# EAGLE design bot_power supply pcb (EAGLE 9.6.2)
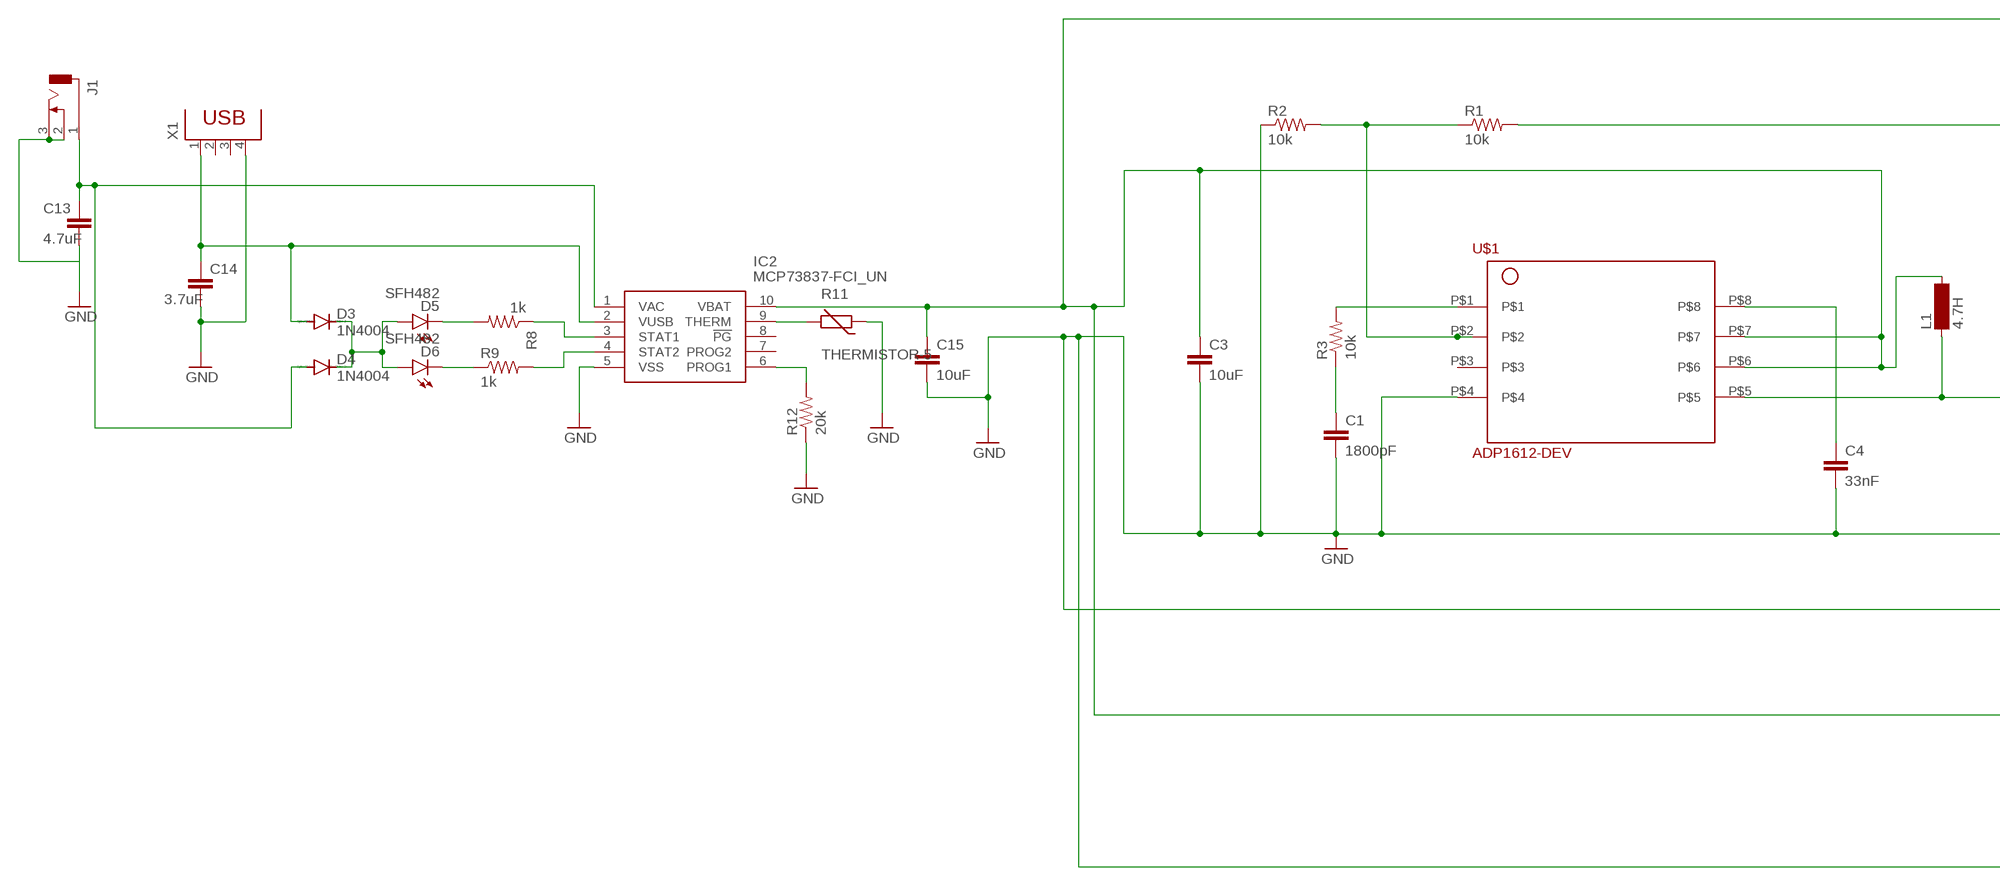
[diagram p0: schematic, sheet 1, part 1 of 2]
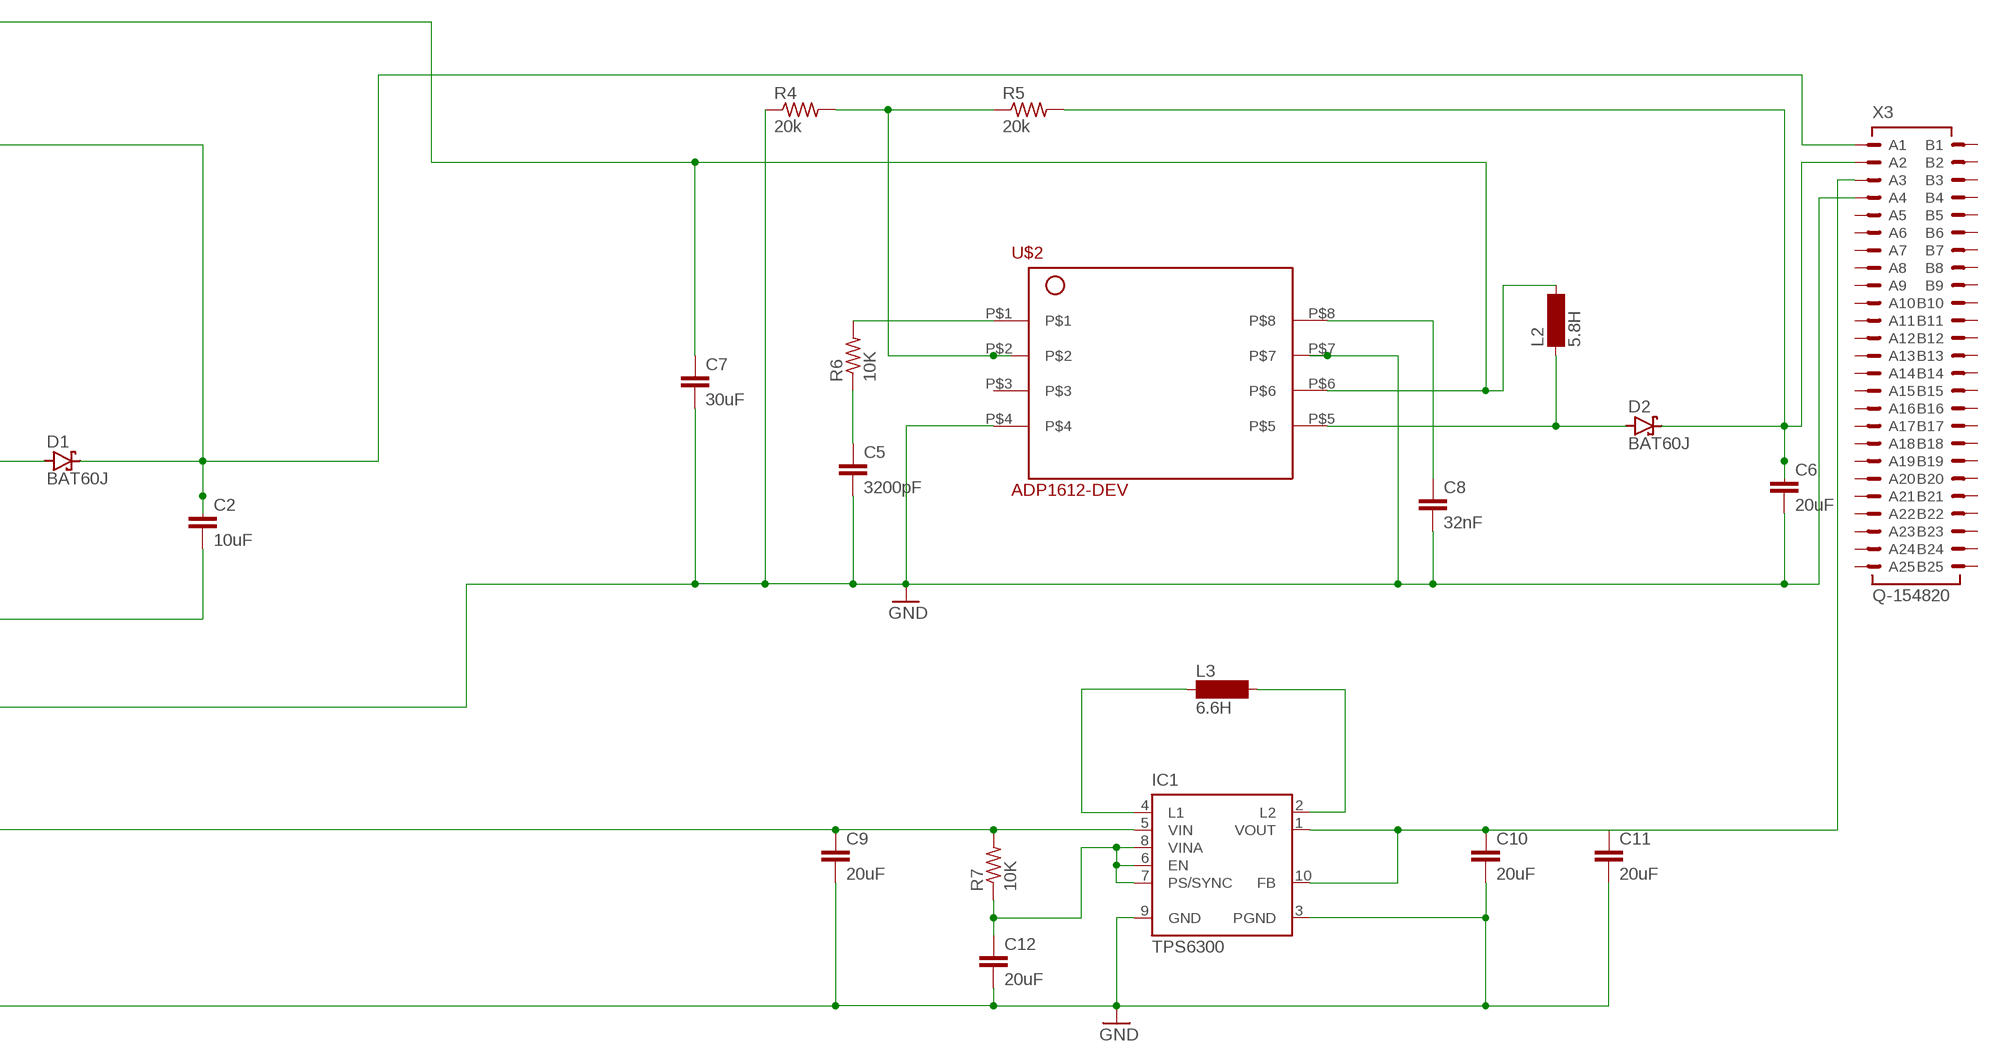
[diagram p1: schematic, sheet 1, part 2 of 2]

## Parts
C1  1800pF  C2.5/4  [C2.5-4]
C2  10uF  C2.5/4  [C2.5-4]
C3  10uF  C2.5/4  [C2.5-4]
C4  33nF  C2.5/4  [C2.5-4]
C5  3200pF  C2.5/4  [C2.5-4]
C6  20uF  C2.5/4  [C2.5-4]
C7  30uF  C2.5/4  [C2.5-4]
C8  32nF  C2.5/4  [C2.5-4]
C9  20uF  C2,5-3  [C2.5-3]
C10  20uF  C2,5-3  [C2.5-3]
C11  20uF  C2,5-3  [C2.5-3]
C12  20uF  C2,5-3  [C2.5-3]
C13  4.7uF  C2,5-3  [C2.5-3]
C14  3.7uF  C2,5-3  [C2.5-3]
C15  10uF  C2,5-3  [C2.5-3]
D1  BAT60J  [SOD323_ST]
D2  BAT60J  [SOD323_ST]
D3  1N4004  [DO41-10]
D4  1N4004  [DO41-10]
D5  SFH482  [SFH482]
D6  SFH482  [SFH482]
IC1  TPS6300  [DRC-S-PVSON-N10]
IC2  MCP73837-FCI_UN  [SOP50P490X110-10N]
J1  DCJ0303  [DCJ0303]
L1  4.7H  BS11  [BS11]
L2  5.8H  BS11  [BS11]
L3  6.6H  BS75  [BS75]
R1  10k  R-US_0204/7  [0204/7]
R2  10k  R-US_0204/7  [0204/7]
R3  10k  R-US_0204/7  [0204/7]
R4  20k  R-US_0204/7  [0204/7]
R5  20k  R-US_0204/7  [0204/7]
R6  10K  R-US_0204/7  [0204/7]
R7  10K  R-US_0204/5  [0204/5]
R8  1k  R-US_0204/5  [0204/5]
R9  1k  R-US_0204/5  [0204/5]
R11  THERMISTOR-5  [R-5]
R12  20k  R-US_0204/5  [0204/5]
U$1  ADP1612-DEV  [TQFP-ADP1612]
U$2  ADP1612-DEV  [TQFP-ADP1612]
X1  PN61729  [PN61729]
X3  Q-154820  [154820]

## Nets
GND: C1.2 C2.2 C3.2 C4.2 C5.2 C6.2 C7.2 C8.2 C9.2 C10.2 C11.2 C12.2 C13.2 C14.1 C14.2 C15.2 D3.A IC1.3(PGND) IC1.9(GND) IC2.2(VUSB) IC2.5(VSS) J1.2 J1.3 R2.1 R4.1 R11.1 R12.1 U$1.P$4 U$2.P$4 U$2.P$7 X1.1 X1.4 X3.A4
N$1: R3.2 U$1.P$1
N$2: C1.1 R3.1
N$3: R1.1 R2.2 U$1.P$2
N$4: C2.1 D1.C R1.2 X3.A1
N$5: D1.A L1.1 U$1.P$5
N$6: C4.1 U$1.P$8
N$8: C3.1 C7.1 C9.1 C15.1 IC1.5(VIN) IC2.10(VBAT) L1.2 L2.2 R7.2 U$1.P$6 U$1.P$7 U$2.P$6
N$9: R6.2 U$2.P$1
N$10: C5.1 R6.1
N$11: R4.2 R5.1 U$2.P$2
N$12: C6.1 D2.C R5.2 X3.A2
N$13: C8.1 U$2.P$8
N$14: D2.A L2.1 U$2.P$5
N$16: IC1.4(L1) L3.1
N$17: IC1.2(L2) L3.2
N$18: C10.1 C11.1 IC1.1(VOUT) IC1.10(FB) X3.A3
N$19: IC2.9(THERM) R11.2
N$20: C12.1 IC1.6(EN) IC1.7(PS/SYNC) IC1.8(VINA) R7.1
N$21: IC2.6(PROG1) R12.2
N$22: D5.K(C) R8.2
N$23: D6.K(C) R9.1
N$24: C13.1 D4.A IC2.1(VAC) J1.1
N$25: IC2.3(STAT1) R8.1
N$26: IC2.4(STAT2) R9.2
N$28: D3.C D4.C D5.A D6.A
Unconnected: IC1.TH IC2.7(PROG2) IC2.8(!PG) U$1.P$3 U$2.P$3 X1.2 X1.3 X3.A5 X3.A6 X3.A7 X3.A8 X3.A9 X3.A10 X3.A11 X3.A12 X3.A13 X3.A14 X3.A15 X3.A16 X3.A17 X3.A18 X3.A19 X3.A20 X3.A21 X3.A22 X3.A23 X3.A24 X3.A25 X3.B1 X3.B2 X3.B3 X3.B4 X3.B5 X3.B6 X3.B7 X3.B8 X3.B9 X3.B10 X3.B11 X3.B12 X3.B13 X3.B14 X3.B15 X3.B16 X3.B17 X3.B18 X3.B19 X3.B20 X3.B21 X3.B22 X3.B23 X3.B24 X3.B25

## Library data of the parts
C1-C15 = capacitor-wima:C: CAPACITOR naming: grid - package width
D1 D2 = diode:BAT60J: Schottky barrier diode Source: www.st.com, BAT60J.pdf
D3 D4 = diode:1N4004: DIODE general purpose rectifier, 1 A
D5 D6 = led:SFH482: IR LED infrared emitting diode, Infineon
IC1 = texas:TPS6300*: HIGH EFFICIENT SINGLE INDUCTOR BUCK-BOOST CONVERTER WITH 1.8-A SWITCHES Source: http://focus.ti.com/lit/ds/symlink/tps63001.pdf; MPN: TPS63000DRCTG4; OC_FARNELL: 1511852; OC_NEWARK: 59M7217
IC2 = MCP73837-FCI_UN:MCP73837-FCI_UN: Li-Ion Charger USB/DC 4.2V 1A PG MSOP10 Source: Datasheet <http://ww1.microchip.com/downloads/en/DeviceDoc/22071B.pdf>; ARROW_PART_NUMBER: MCP73837-FCI/UN; ARROW_PRICE-STOCK: https://www.arrow.com/en/products/mcp73837-fciun/microchip-technology; DESCRIPTION: Li-Ion Charger USB/DC 4.2V 1A PG MSOP10; HEIGHT: 1.1mm; MANUFACTURER_NAME: Microchip; MANUFACTURER_PART_NUMBER: MCP73837-FCI/UN; MOUSER_PART_NUMBER: 579-MCP73837-FCI/UN; MOUSER_PRICE-STOCK: https://www.mouser.co.uk/ProductDetail/Microchip-Technology/MCP73837-FCI-UN?qs=hH%252BOa0VZEiDKGj395FRsiw%3D%3D
J1 = con-jack:DCJ0303: DC POWER JACK Source: DCJ0303.pdf; OC_FARNELL: unknown; OC_NEWARK: unknown
L1-L3 = inductor-neosid:BS: INDUCTOR nominal inductance, magnetically screened; OC_FARNELL: unknown; OC_NEWARK: unknown
R1-R9 R12 = rcl:R-US_: RESISTOR, American symbol; SPICEPREFIX: R
R11 = varistor:THERMISTOR: THERMISTOR
U$1 U$2 = ADP1612:ADP1612-DEV
X1 = con-berg:PN61729: BERG USB connector; OC_FARNELL: unknown; OC_NEWARK: unknown
X3 = con-erni:Q-154820: Male Connector SMC-Q 50 contacts Type 7-13 - Low Profile Source: http://www.erni.com/DB/PDF-Drawing/SMC/154820.pdf; OC_FARNELL: unknown; OC_NEWARK: unknown

## Board
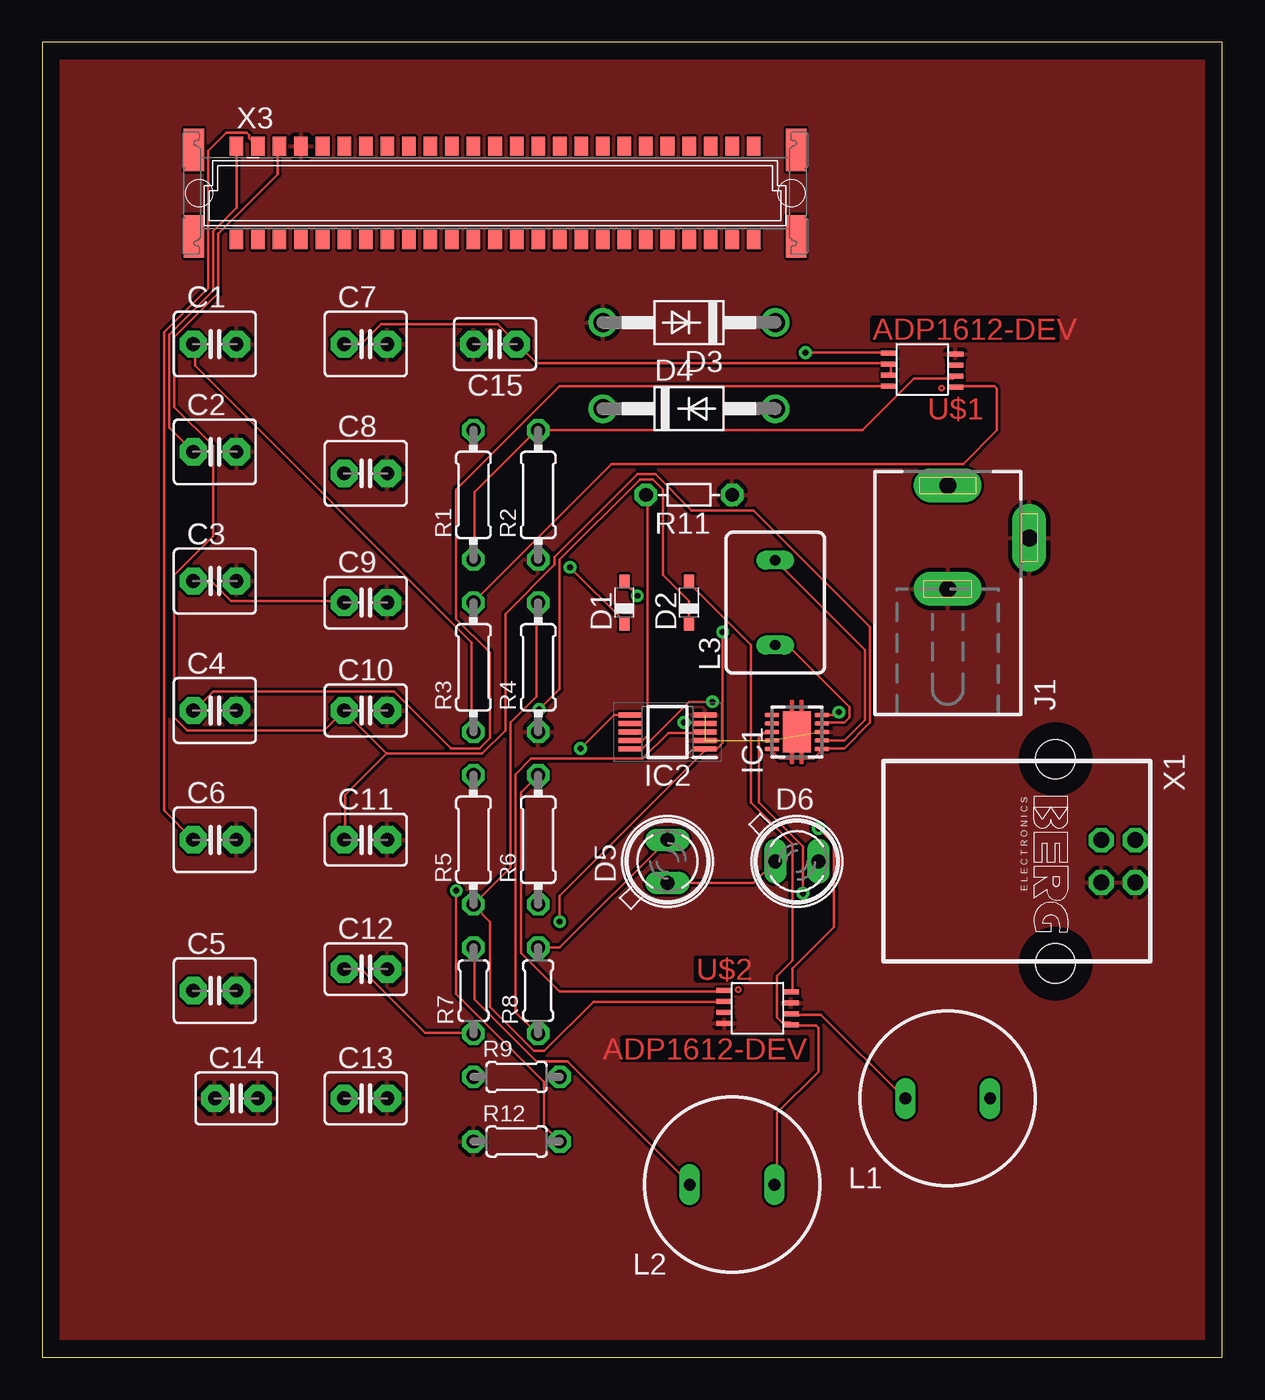
[diagram p2: board, top side]
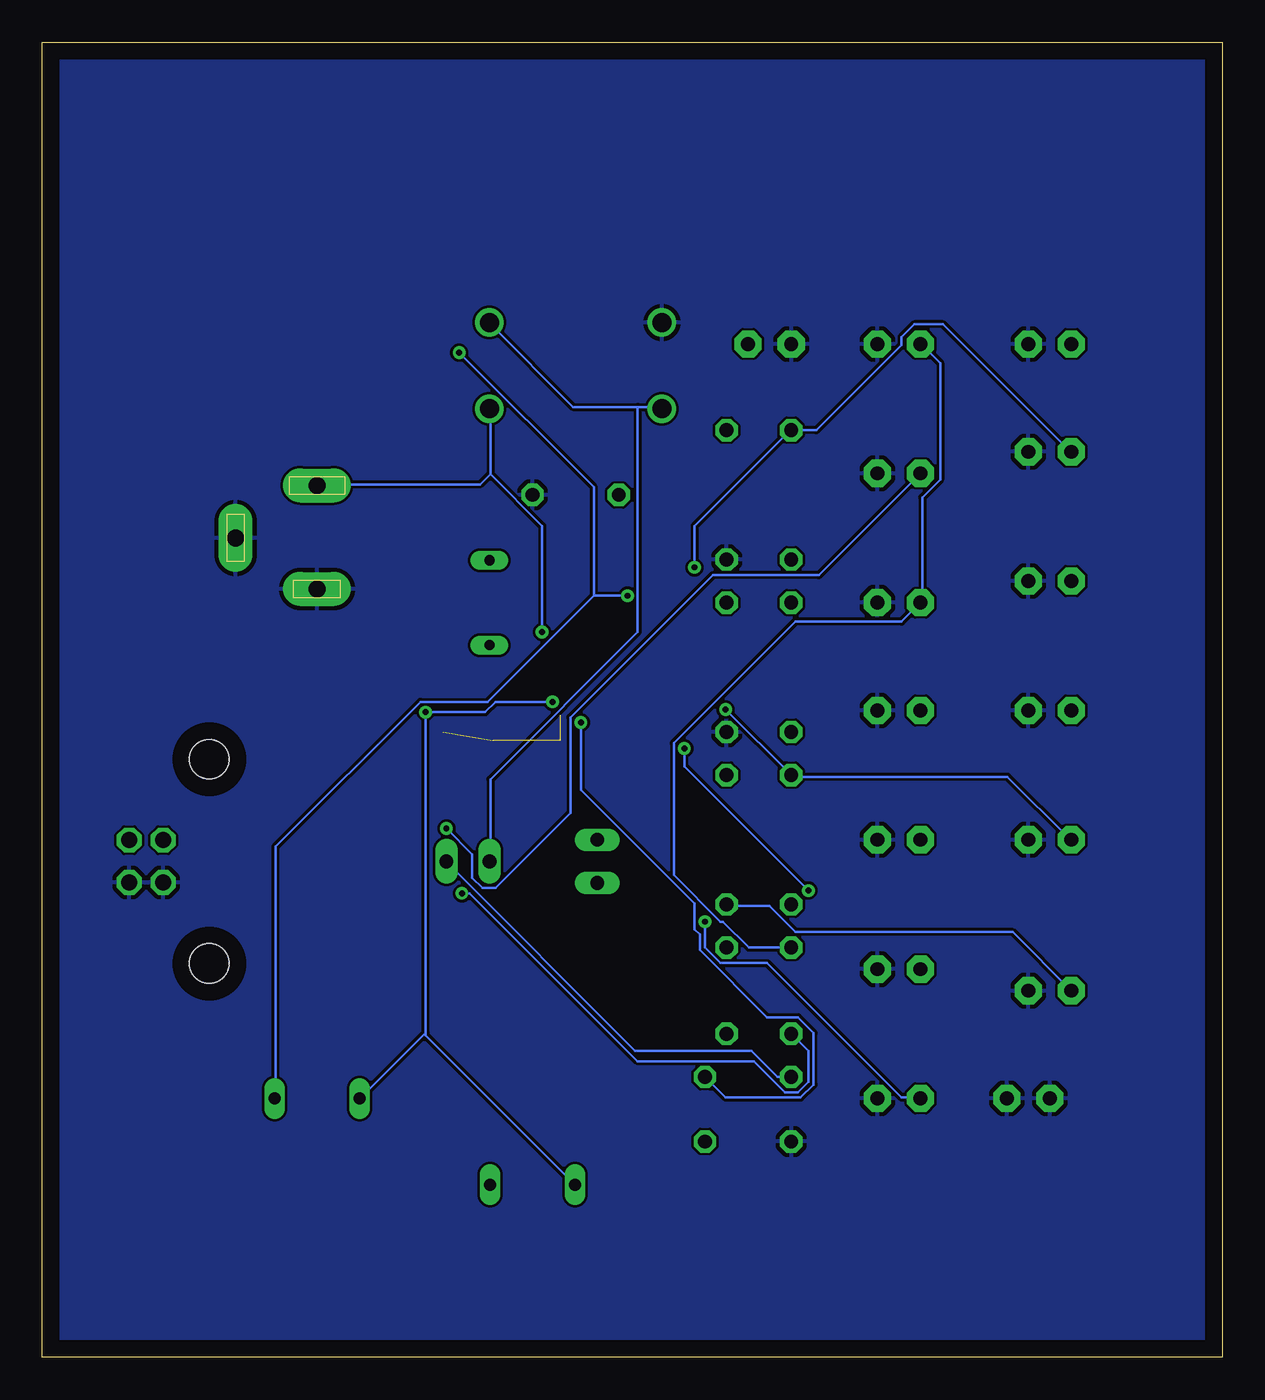
[diagram p3: board, bottom side, seen from below]

Size 69.52 x 77.46 mm. Coordinates in mm from the lower left corner, seen from the top.
Outline: 0,0 69.52,0 69.52,77.46 0,77.46 0,0
Copper layers (1*16): Top 0.035mm / dielectric 1.5mm / Bottom 0.035mm
Design rules "default": minimum track width 6mil, minimum drill 0.35mm, track to track 6mil, track to pad 6mil, pad to pad 6mil, via to via 6mil, smd to smd 6mil, copper to edge 40mil, drill to drill 6mil, minimum pad ring 10mil, minimum via ring 8mil, stop-mask expansion 4mil, vias tented up to drill 0mil, thermal gap 10mil

### Footprints (pad centres in the part's own frame; a part is rotated, then mirrored left to right if it is on the bottom)
C2.5-4 = drill 0.813 pad 1.6 octagon: 1 -1.27,0; 2 1.27,0
C2.5-3 = drill 0.813 pad 1.6 octagon: 1 -1.27,0; 2 1.27,0
SOD323_ST = smd 0.8 x 0.6: A 1.25,0; C -1.25,0
DO41-10 = drill 1.118: A 5.08,0; C -5.08,0
SFH482 = drill 0.813 long: A -1.27,0; K 1.27,0
DRC-S-PVSON-N10 = smd 0.28 x 0.85: 1 -1,-1.475; 2 -0.5,-1.475; 3 0,-1.475; 4 0.5,-1.475; 5 1,-1.475; 6 1,1.475; 7 0.5,1.475; 8 0,1.475; 9 -0.5,1.475; 10 -1,1.475 | smd 2.4 x 1.65: TH 0,0
SOP50P490X110-10N = smd 1.4 x 0.3: 1 -2.2,1; 2 -2.2,0.5; 3 -2.2,0; 4 -2.2,-0.5; 5 -2.2,-1; 6 2.2,-1; 7 2.2,-0.5; 8 2.2,0; 9 2.2,0.5; 10 2.2,1
DCJ0303 = drill 1 pad 2 long: 1 0,3.1; 2 4.8,0; 3 0,-3
BS11 = drill 0.7 long: 1 -2.5,0; 2 2.5,0
BS75 = drill 0.6 long: 1 -2.5,0; 2 2.5,0
0204/7 = drill 0.813 octagon: 1 -3.81,0; 2 3.81,0
0204/5 = drill 0.813 octagon: 1 -2.54,0; 2 2.54,0
R-5 = drill 0.813 octagon: 1 -2.54,0; 2 2.54,0
TQFP-ADP1612 = smd 0.95 x 0.3: P$1 -0.45,2.55; P$2 -0.45,1.9; P$3 -0.45,1.25; P$4 -0.45,0.6; P$5 3.45,0.525; P$6 3.45,1.175; P$7 3.45,1.825; P$8 3.45,2.475
PN61729 = drill 0.95 octagon: 1 1.25,4.71; 2 -1.25,4.71; 3 -1.25,2.71; 4 1.25,2.71 | hole 2.3: -6.02,0; 6.02,0
154820 = smd 0.8 x 1.1: A1 -15.24,2.765; A2 -13.97,2.765; A3 -12.7,2.765; A4 -11.43,2.765; A5 -10.16,2.765; A6 -8.89,2.765; A7 -7.62,2.765; A8 -6.35,2.765; A9 -5.08,2.765; A10 -3.81,2.765; A11 -2.54,2.765; A12 -1.27,2.765; A13 0,2.765; A14 1.27,2.765; A15 2.54,2.765; A16 3.81,2.765; A17 5.08,2.765; A18 6.35,2.765; A19 7.62,2.765; A20 8.89,2.765; A21 10.16,2.765; A22 11.43,2.765; A23 12.7,2.765; A24 13.97,2.765; A25 15.24,2.765; B1 -15.24,-2.74; B2 -13.97,-2.74; B3 -12.7,-2.74; B4 -11.43,-2.74; B5 -10.16,-2.74; B6 -8.89,-2.74; B7 -7.62,-2.74; B8 -6.35,-2.74; B9 -5.08,-2.74; B10 -3.81,-2.74; B11 -2.54,-2.74; B12 -1.27,-2.74; B13 0,-2.74; B14 1.27,-2.74; B15 2.54,-2.74; B16 3.81,-2.74; B17 5.08,-2.74; B18 6.35,-2.74; B19 7.62,-2.74; B20 8.89,-2.74; B21 10.16,-2.74; B22 11.43,-2.74; B23 12.7,-2.74; B24 13.97,-2.74; B25 15.24,-2.74 | smd 1.2 x 2.5: M1 -17.745,2.55; M2 -17.745,-2.55; M3 17.745,-2.55; M4 17.745,2.55

### Placement (x,y rotation side)
C1  10.16,59.69 0 top
C2  10.16,53.34 0 top
C3  10.16,45.72 0 top
C4  10.16,38.1 0 top
C5  10.16,21.59 0 top
C6  10.16,30.48 0 top
C7  19.05,59.69 0 top
C8  19.05,52.07 0 top
C9  19.05,44.45 0 top
C10  19.05,38.1 0 top
C11  19.05,30.48 0 top
C12  19.05,22.86 0 top
C13  19.05,15.24 0 top
C14  11.43,15.24 0 top
C15  26.67,59.69 180 top
D1  34.29,44.45 90 top
D2  38.1,44.45 90 top
D3  38.1,60.96 180 top
D4  38.1,55.88 0 top
D5  36.83,29.21 90 top
D6  44.45,29.21 0 top
IC1  44.45,36.83 90 top
IC2  36.83,36.83 180 top
J1  53.34,48.26 0 top
L1  53.34,15.24 180 top
L2  40.64,10.16 180 top
L3  43.18,44.45 90 top
R1  25.4,50.8 90 top
R2  29.21,50.8 90 top
R3  25.4,40.64 90 top
R4  29.21,40.64 90 top
R5  25.4,30.48 90 top
R6  29.21,30.48 90 top
R7  25.4,21.59 90 top
R8  29.21,21.59 90 top
R9  27.94,16.51 0 top
R11  38.1,50.8 180 top
R12  27.94,12.7 0 top
U$1  53.34,59.69 180 top
U$2  40.64,19.05 0 top
X1  59.69,29.21 270 top
X3  26.67,68.58 0 top

### Tracks (layer width: path | path; a pad name or v marks a point on that pad's centre or on a via)
GND  (3 unrouted)
  pour Top: -2.54,80.01 -2.54,-2.54 72.39,-2.54 72.39,80.01
  pour Bottom: -5.08,82.55 -5.08,-5.08 74.93,-5.08 74.93,82.55
N$1
  Top 0.152: U$1.P$1 53.8,57.2 56.08,57.2 56.24,57.05 56.24,54.61 54.25,52.63 33.53,52.63 25.45,44.55 R3.2
N$2
  Top 0.152: R3.1 25.3,36.93 25.3,42.11 8.99,58.42 8.99,59.64 C1.1
N$3
  Top 0.152: U$1.P$2 53.65,57.66 51.36,57.66 48.31,54.61 R2.2 29.11,54.61 25.45,50.95 25.45,46.99 R1.1
N$4  (via drill 0.35)
  Top 0.152: v31.09,46.53 34.29,43.33 D1.C | X3.A1 11.43,67.72 10.06,66.34 10.06,62.84 7.47,60.25 7.47,54.76 C2.1
  Bottom 0.152: v31.09,46.53 31.09,48.97 25.45,54.61 R1.2 23.93,54.61 18.9,59.64 18.9,60.1 18.14,60.86 16.46,60.86 8.99,53.39 C2.1
N$5  (via drill 0.35)
  Top 0.152: v35.05,44.86 34.29,45.62 D1.A | v44.96,59.18 49.84,59.18 U$1.P$5
  Bottom 0.152: 37.03,44.86 v35.05,44.86 | 37.03,44.86 43.28,38.61 47.24,38.61 55.78,30.07 55.78,15.29 L1.1 | v44.96,59.18 37.03,51.26 37.03,44.86
N$6
  Top 0.152: U$1.P$8 49.84,57.2 30.48,57.2 24.38,51.1 24.38,43.48 26.36,41.5 26.36,36.47 25.76,35.87 24.08,35.87 20.73,39.22 10.06,39.22 8.99,38.15 C4.1
N$8  (via drill 0.35)
  Top 0.152: v46.94,38 46.79,37.85 46.02,37.85 IC1.5 | U$2.P$6 44.2,20.17 45.87,20.17 50.75,15.29 L1.2 | v39.47,38.61 38.1,38.61 35.36,35.87 34.75,35.87 IC2.10 | R7.2 25.45,24.13 25.45,21.08 29.11,17.42 30.94,17.42 38.1,10.26 L2.2 | C3.1 8.99,45.62 10.06,45.62 11.12,44.55 17.68,44.55 C9.1 | U$1.P$7 49.99,57.96 49.99,58.42 U$1.P$6 49.84,58.57 29.11,58.57 28.04,59.64 C15.1 27.89,59.79 26.82,60.86 19.96,60.86 18.9,59.79 17.83,59.79 C7.1
  Bottom 0.152: 46.94,19.1 v46.94,38 43.43,38 42.82,38.61 v39.47,38.61 | 46.94,19.1 50.75,15.29 L1.2 | 46.94,19.1 46.94,18.95 38.25,10.26 L2.2 | C7.1 17.68,59.64 16.61,58.57 16.61,51.71 17.68,50.65 17.68,44.55 C9.1 18.9,43.33 25.15,43.33 32.31,36.17 32.31,28.4 29.57,25.65 29.41,25.65 27.89,24.13 R7.2
N$9
  Top 0.152: R6.2 28.19,33.27 28.19,23.83 30.48,21.54 40.08,21.54 U$2.P$1
N$10
  Bottom 0.152: C5.1 12.34,25.04 25.15,25.04 26.67,26.57 29.11,26.57 R6.1
N$11
  Top 0.152: U$2.P$2 40.08,20.93 32.46,20.93 29.57,18.03 28.96,18.03 26.36,20.62 26.36,25.65 25.45,26.57 R5.1 27.58,28.85 27.58,37.39 29.11,38.91 29.11,44.4 R4.2
N$12  (via drill 0.35)
  Top 0.152: D2.C 38.1,44.55 36.58,46.08 36.58,51.1 35.97,51.71 35.2,51.71 30.48,46.99 30.48,39.37 v29.26,38.15 | C6.1 7.16,32.21 7.16,60.4 9.75,62.99 9.75,71.07 10.82,72.14 12.04,72.14 12.19,71.98 12.19,71.83 12.65,71.37 X3.A2
  Bottom 0.152: v29.26,38.15 R5.2 25.3,34.19 12.65,34.19 8.99,30.53 C6.1
N$13  (via drill 0.35)
  Top 0.152: v45.72,31.14 46.63,30.23 46.63,25.35 44.2,22.91 44.2,21.54 U$2.P$8
  Bottom 0.152: v45.72,31.14 44.2,29.62 44.2,28.24 43.59,27.63 42.82,27.63 38.41,32.05 38.41,37.69 30.02,46.08 23.77,46.08 C8.1
N$14
  Top 0.152: D2.A 38.1,45.62 41.76,41.96 41.76,32.66 44.2,30.23 44.2,23.37 43.28,22.45 43.28,20.02 43.59,19.71 44.04,19.71 U$2.P$5 44.2,19.56 45.57,19.56 45.72,19.41 45.72,16.81 43.28,14.38 43.28,10.26 L2.1
N$16
  Top 0.152: IC1.4 46.02,37.39 47.24,37.39 47.55,37.69 47.55,38.3 44.04,41.81 43.28,41.81 L3.1
N$17
  Top 0.152: IC1.2 46.02,36.32 47.24,36.32 48.46,37.54 48.46,41.66 43.28,46.84 L3.2
N$18
  Top 0.152: IC1.10 42.98,35.71 43.43,35.25 45.41,35.25 45.87,35.71 IC1.1 46.02,35.87 47.24,35.87 48.77,37.39 48.77,43.03 41.91,49.89 38.25,49.89 36.12,52.02 35.05,52.02 30.18,47.14 30.18,46.68 27.28,43.79 27.28,36.93 25.91,35.56 20.27,35.56 | X3.A3 13.87,71.22 13.87,69.7 10.36,66.19 10.36,62.69 7.77,60.1 7.77,55.98 10.06,53.7 10.06,48.36 7.77,46.08 7.77,37.69 8.53,36.93 16.61,36.93 C10.1 17.83,38 20.27,35.56 | 20.27,35.56 17.83,33.12 17.83,30.53 C11.1
N$19
  Top 0.152: IC2.9 34.75,36.32 35.36,36.32 35.66,36.63 35.66,50.8 R11.2
N$20  (via drill 0.35)
  Top 0.152: IC1.6 42.98,37.69 42.98,37.39 IC1.7 42.98,37.24 42.98,36.93 IC1.8 42.82,36.78 42.52,36.78 42.22,36.47 42.22,32.66 44.81,30.07 v44.81,27.33 | C12.1 17.83,22.76 18.9,22.76 22.55,19.1 25.3,19.1 R7.1
  Bottom 0.152: v44.81,27.33 44.35,27.33 34.44,17.42 27.58,17.42 25.76,15.6 24.99,15.6 24.38,16.2 24.38,18.03 R7.1
N$21  (via drill 0.35)
  Top 0.152: v31.7,35.87 33.68,37.85 34.59,37.85 IC2.6 | v24.38,27.48 24.38,21.39 29.57,16.2 29.57,13.61 R12.2
  Bottom 0.152: v31.7,35.87 31.7,34.8 v24.38,27.48
N$22
  Top 0.152: R8.2 30.48,24.13 D5.K
N$23
  Bottom 0.152: R9.1 26.21,16.51 27.74,18.03 34.59,18.03 45.72,29.16 D6.K
N$24  (via drill 0.35)
  Top 0.152: v40.08,42.72 40.08,36.17 39.78,35.87 39.17,35.87 IC2.1 39.01,35.71 30.48,27.18 v30.48,25.65
  Bottom 0.152: v40.08,42.72 40.08,48.97 43.13,52.02 | 43.13,52.02 43.13,55.83 D4.A | v30.48,25.65 30.48,24.13 29.57,23.22 26.82,23.22 18.9,15.29 17.83,15.29 C13.1 | 43.13,52.02 43.74,51.41 53.34,51.41 J1.1
N$25
  Top 0.152: IC2.3 39.01,36.78 36.88,36.78 35.36,35.25 28.8,35.25 27.89,34.34 27.89,20.32 29.11,19.1 R8.1
N$26  (via drill 0.35)
  Top 0.152: v37.8,37.39 39.01,37.39 IC2.4
  Bottom 0.152: v37.8,37.39 37.8,33.43 31.09,26.72 31.09,25.2 30.79,24.89 30.79,23.98 26.82,20.02 24.99,20.02 24.08,19.1 24.08,16.05 24.84,15.29 29.26,15.29 R9.2
N$28
  Top 0.152: D5.A 41.91,27.94 D6.A
  Bottom 0.152: 34.44,55.98 38.25,55.98 43.13,60.86 D3.C | 34.44,55.98 33.07,55.98 D4.C | 34.44,55.98 34.44,42.72 43.13,34.04 43.13,29.31 D6.A